# Altium schematic sheet Power Architechture.SchDoc: Power Block Diagram
size 292 x 193 mm; SheetNumber: 2; SheetTotal: 40
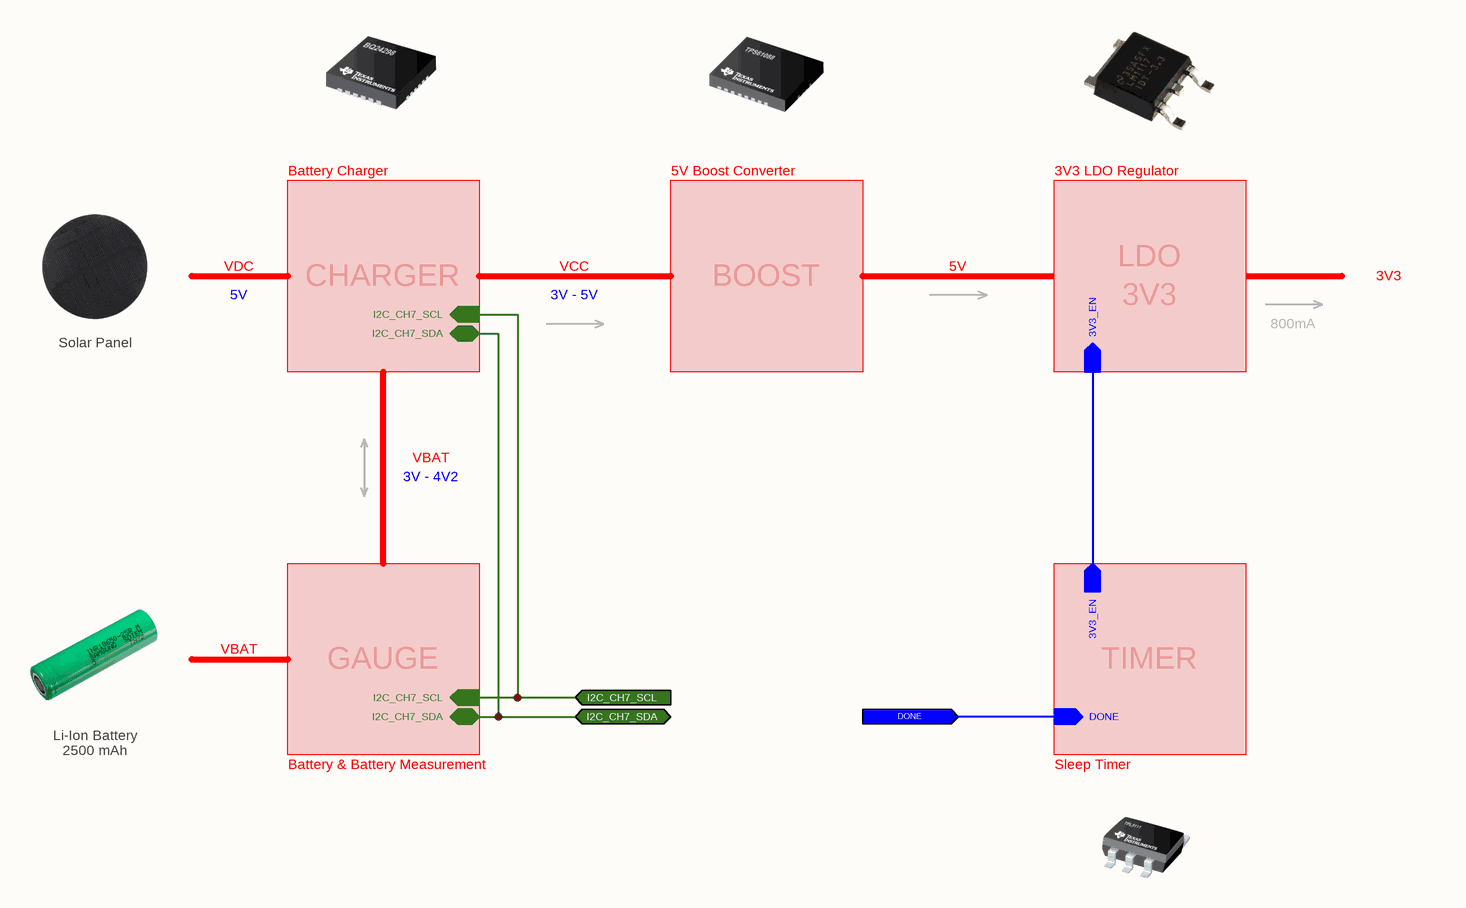
[diagram p0: Power Architechture.SchDoc]

## Sub-sheets
3V3 LDO Regulator = Power 3V3 Regulator.SchDoc: 3V3_EN (in)
5V Boost Converter = Power 5V Boost Converter.SchDoc: no entries
Battery & Battery Measurement = Power Battery Measurement.SchDoc: I2C_CH7_SCL (in), I2C_CH7_SDA (bidir)
Battery Charger = Power Battery Charger.SchDoc: I2C_CH7_SDA (bidir), I2C_CH7_SCL (in)
Sleep Timer = Power Sleep Timer.SchDoc: 3V3_EN (out), DONE (in)

## Ports
DONE (in), I2C_CH7_SCL (in), I2C_CH7_SDA (bidir)

## Nets
DONE: port DONE, sheet Sleep Timer/DONE
I2C_CH7_SCL: port I2C_CH7_SCL, sheet Battery & Battery Measurement/I2C_CH7_SCL, sheet Battery Charger/I2C_CH7_SCL
I2C_CH7_SDA: port I2C_CH7_SDA, sheet Battery & Battery Measurement/I2C_CH7_SDA, sheet Battery Charger/I2C_CH7_SDA
(unnamed): sheet 3V3 LDO Regulator/3V3_EN, sheet Sleep Timer/3V3_EN

## Notes on the sheet
- VDC
- 5V
- CHARGER
- VCC
- 3V - 5V
- BOOST
- LDO
- 3V3
- Solar Panel
- 800mA
- VBAT
- 3V - 4V2
- GAUGE
- TIMER
- Li-Ion Battery
  2500 mAh
- © 2021 All rights reserved.
  This document may not, in whole or in part, be copied, photocopied, reproduced, translated or converted to any electronic or machine readable from without prior written permission of Mehmet Günce Akkoyun.
  Engineer contact : akkoyun@me.com
- Property of
- Engineer :
- Date :
- Size :
- A4
- Time :
- Project :
- Page :
- /
- Customer :
- Product ID :
- Module ID :
- Version :
- File :
- Revision :